# EasyEDA schematic 10.1.json
TITLE: Sheet_1; REV: 1.0; Date: 2020-05-26; Sheet: 1/1; Company: Your Company
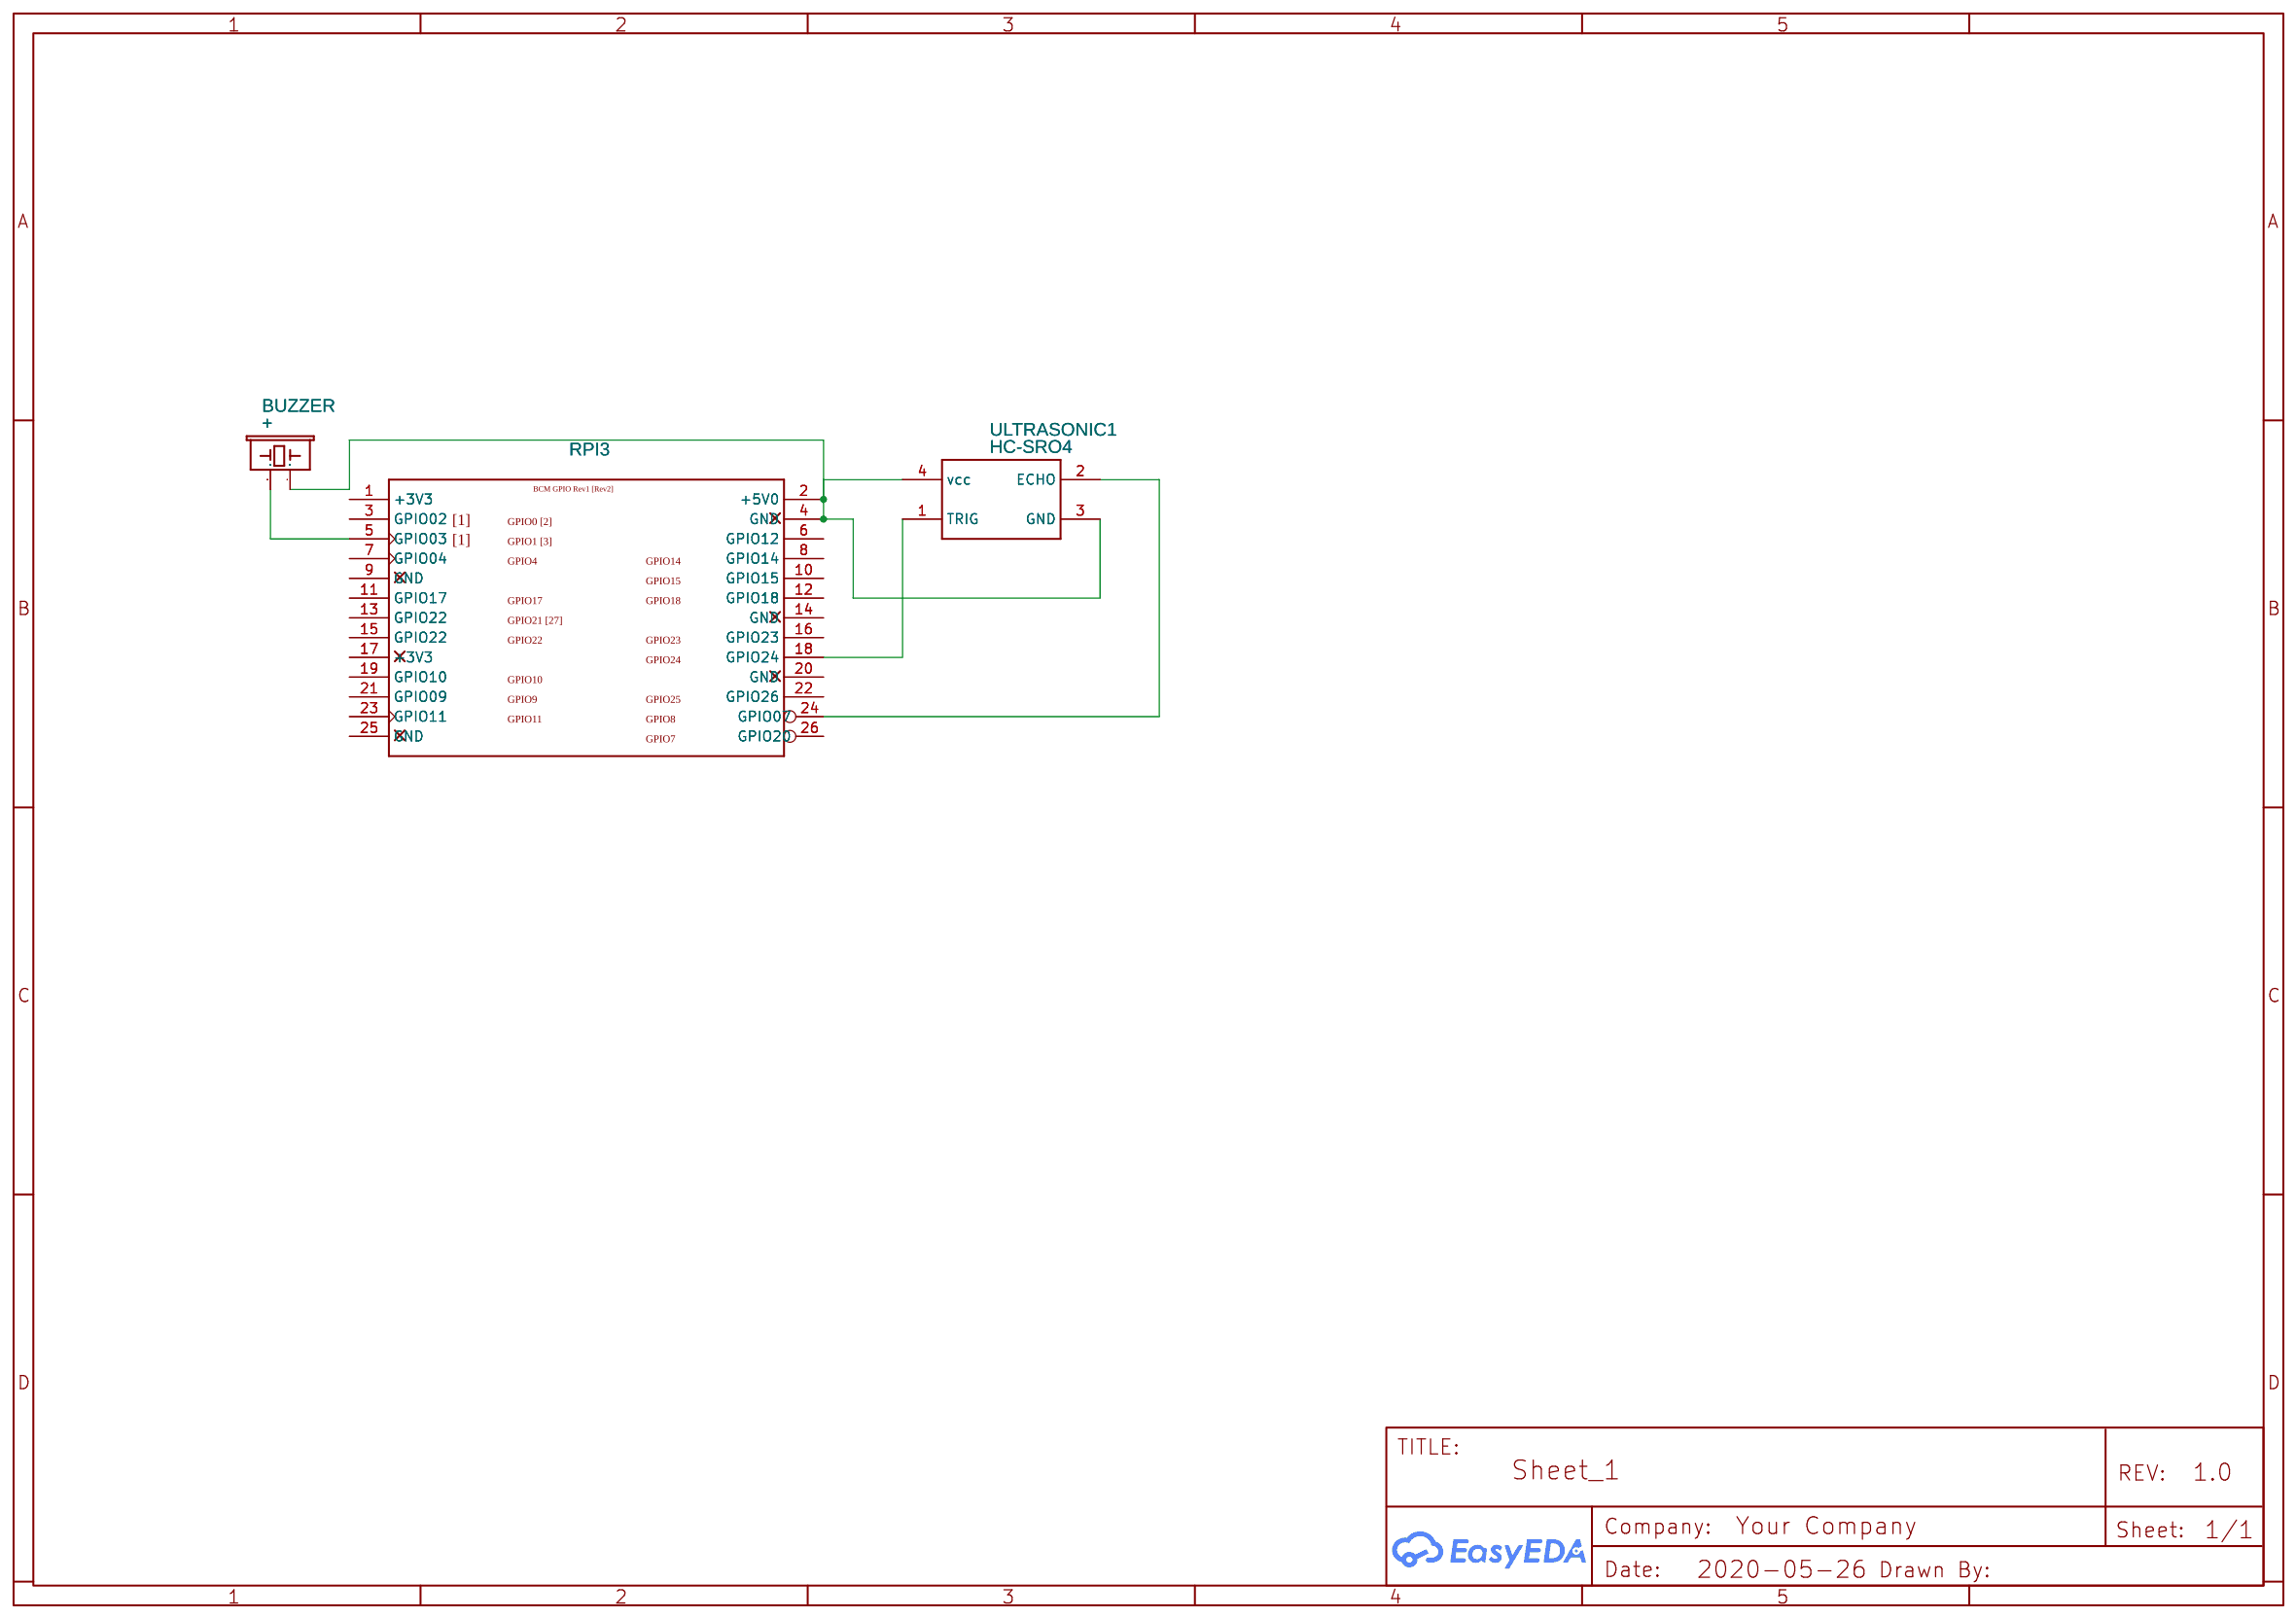
[diagram p0: schematic sheet]

## Parts
BUZZER  +  [BUZZER-CCV]
RPI3  PI-GPIO-CONNECTOR-SMT  [GPIO-CONNECTOR-SMT]
ULTRASONIC1  HC-SRO4  [SPM0204UD5]

## Library data of the parts
BUZZER = BUZZER: Contributor: SparkFun
RPI3 = PI-GPIO-CONNECTOR-SMT
ULTRASONIC1 = SPM0204UD5SMD: Ultrasonic range sensor; Contributor: SparkFun

## Nets
Net-(BUZZER-+): BUZZER.+(1) RPI3.5(GPIO03)
Net-(BUZZER--): BUZZER.-(2) RPI3.2(+5V0) RPI3.4(GND) ULTRASONIC1.3(GND) ULTRASONIC1.4(vcc)
Net-(RPI3-18): RPI3.18(GPIO24) ULTRASONIC1.1(TRIG)
Net-(RPI3-24): RPI3.24(GPIO07) ULTRASONIC1.2(ECHO)

Not connected (* = marked no-connect by the designer): RPI3 1(+3V3) 3(GPIO02) 6(GPIO12) 7(GPIO04) 8(GPIO14) 9(GND) 10(GPIO15) 11(GPIO17) 12(GPIO18) 13(GPIO22) 14(GND) 15(GPIO22) 16(GPIO23) 17(+3V3) 19(GPIO10) 20(GND) 21(GPIO09) 22(GPIO26) 23(GPIO11) 25(GND) 26(GPIO20)
